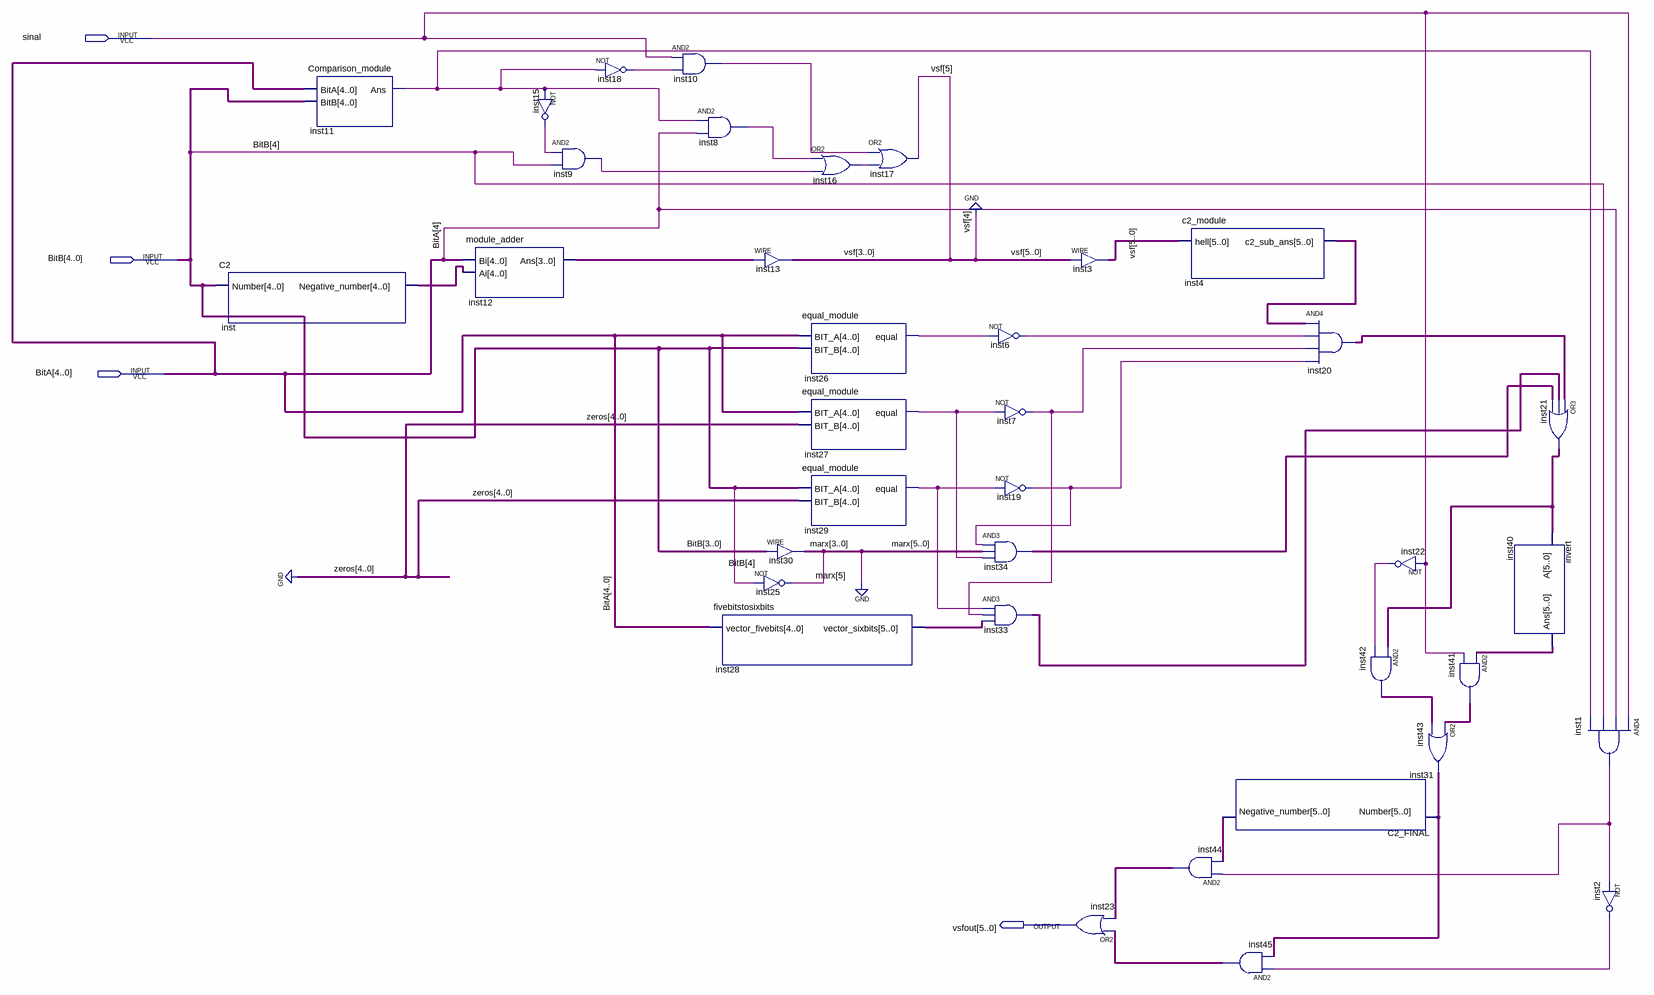
[diagram p0: schematic sheet]
// Quartus schematic circuit_subtrator_complete.bdf as structural Verilog: 37 symbols, 4 pins
module circuit_subtrator_complete (
  input  sinal,
  input  [4:0] BitB,
  input  [4:0] BitA,
  output [5:0] vsfout
);

  wire inst1_out, inst2_out, inst6_out, inst7_out, inst8_out, inst9_out, inst10_out, inst11_ans, inst15_out,
       inst16_out, inst18_out, inst19_out, inst22_out, inst26_equal, inst27_equal, inst29_equal;
  wire [3:0] inst12_ans;
  wire [4:0] inst_negative_number;
  wire [5:0] inst4_c2_sub_ans, inst20_out, inst21_out, inst28_vector_sixbits, inst31_negative_number,
       inst33_out, inst34_out, inst40_ans, inst41_out, inst42_out, inst43_out, inst44_out, inst45_out, marx,
       vsf;

  C2 inst (.Number(BitB), .Negative_number(inst_negative_number));
  Comparison_module inst11 (.BitA(BitA), .BitB(BitB), .Ans(inst11_ans));
  module_adder inst12 (.Bi(BitA), .Ai(inst_negative_number), .Ans(inst12_ans));
  not inst15 (inst15_out, inst11_ans);
  and inst9 (inst9_out, inst15_out, BitB[4]);
  not inst18 (inst18_out, inst11_ans);
  and inst10 (inst10_out, sinal, inst18_out);
  and inst8 (inst8_out, inst11_ans, BitA[4]);
  fivebitstosixbits inst28 (.vector_fivebits(BitA), .vector_sixbits(inst28_vector_sixbits));
  assign vsf[3:0] = inst12_ans;  // WIRE inst13
  assign marx[3:0] = BitB[3:0];  // WIRE inst30
  not inst25 (marx[5], BitB[4]);
  or inst16 (inst16_out, inst8_out, inst9_out);
  equal_module inst26 (.BIT_A(BitA), .BIT_B(BitB), .equal(inst26_equal));
  equal_module inst27 (.BIT_A(BitA), .BIT_B({5{1'b0}}), .equal(inst27_equal));
  equal_module inst29 (.BIT_A(BitB), .BIT_B({5{1'b0}}), .equal(inst29_equal));
  or inst17 (vsf[5], inst10_out, inst16_out);
  assign inst34_out = {6{inst19_out}} & marx & {6{inst27_equal}};  // AND3 inst34, 6 bits wide
  assign inst33_out = {6{inst29_equal}} & {6{inst7_out}} & inst28_vector_sixbits;  // AND3 inst33, 6 bits wide
  not inst6 (inst6_out, inst26_equal);
  not inst7 (inst7_out, inst27_equal);
  not inst19 (inst19_out, inst29_equal);
  assign vsf = vsf;  // WIRE inst3
  assign vsfout = inst45_out | inst44_out;  // OR2 inst23, 6 bits wide
  c2_module inst4 (.hell(vsf), .c2_sub_ans(inst4_c2_sub_ans));
  assign inst44_out = {6{inst1_out}} & inst31_negative_number;  // AND2 inst44, 6 bits wide
  C2_FINAL inst31 (.Number(inst43_out), .Negative_number(inst31_negative_number));
  assign inst45_out = {6{inst2_out}} & inst43_out;  // AND2 inst45, 6 bits wide
  assign inst20_out = inst4_c2_sub_ans & {6{inst6_out}} & {6{inst7_out}} & {6{inst19_out}};  // AND4 inst20, 6 bits wide
  not inst22 (inst22_out, sinal);
  assign inst42_out = inst21_out & {6{inst22_out}};  // AND2 inst42, 6 bits wide
  assign inst43_out = inst41_out | inst42_out;  // OR2 inst43, 6 bits wide
  assign inst41_out = inst40_ans & {6{sinal}};  // AND2 inst41, 6 bits wide
  assign inst21_out = inst20_out | inst33_out | inst34_out;  // OR3 inst21, 6 bits wide
  invert inst40 (.A(inst21_out), .Ans(inst40_ans));
  and inst1 (inst1_out, sinal, BitA[4], BitB[4], inst11_ans);
  not inst2 (inst2_out, inst1_out);
  // also tied to GND on the sheet: vsf[4]
endmodule
